# Altium schematic sheet RFID Sheet 1.SchDoc
size A4; SheetNumber: 1; SheetTotal: 2
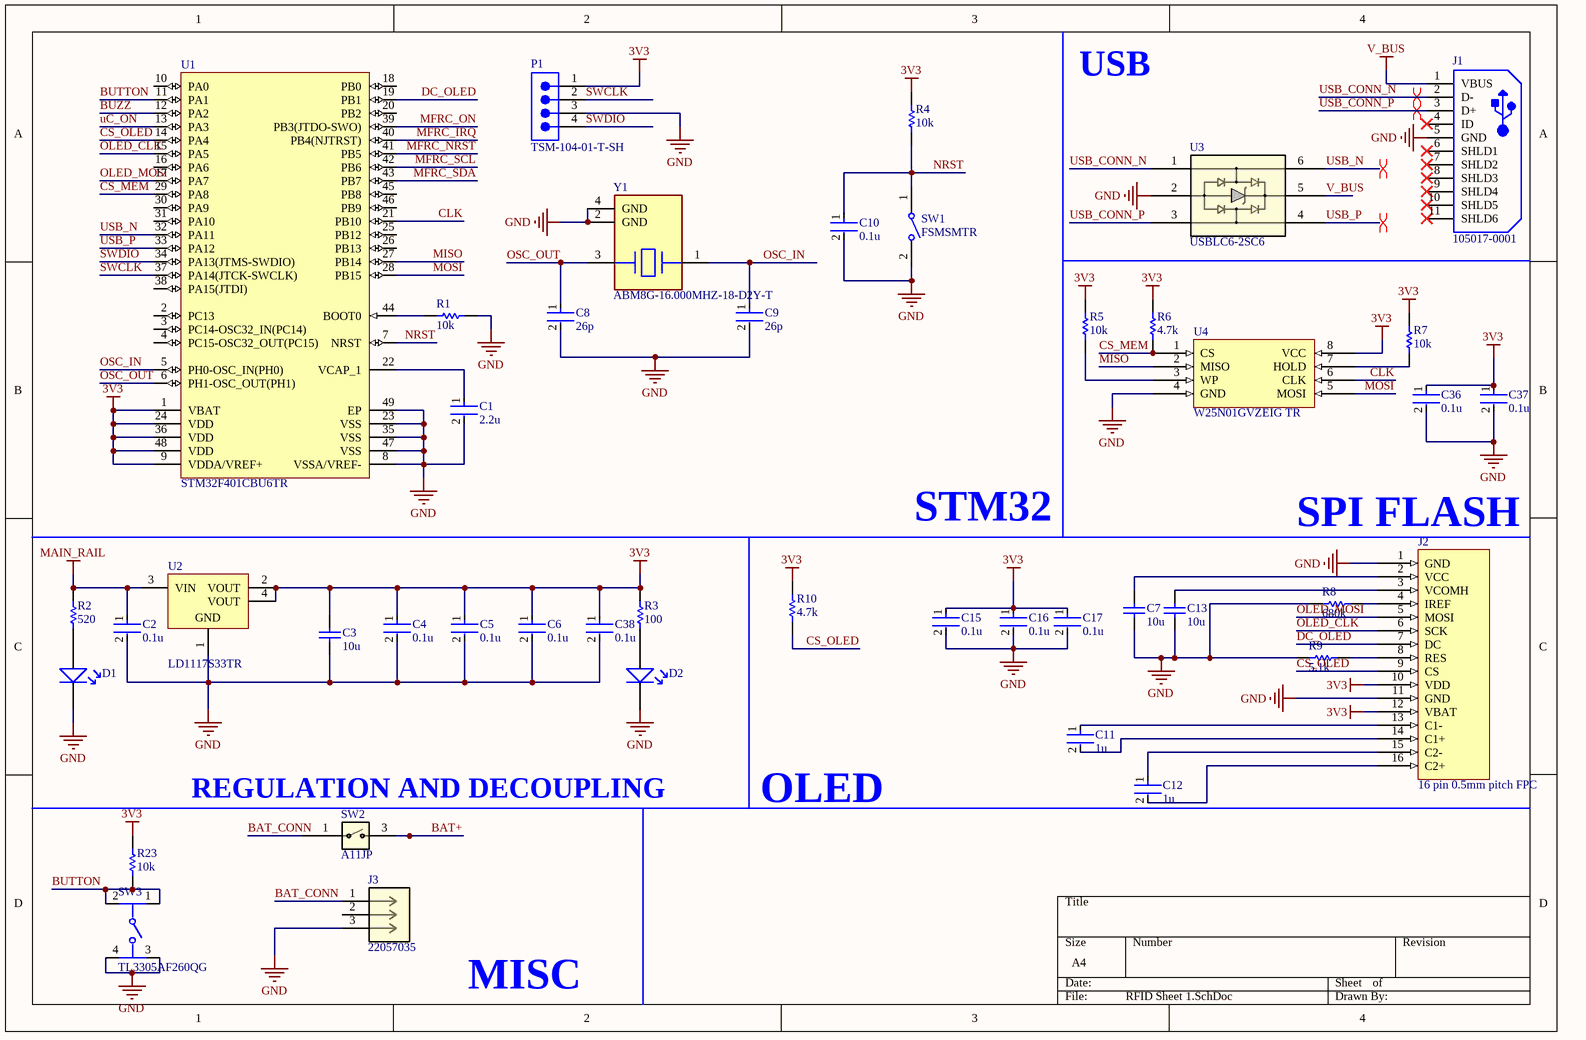
[diagram p0: RFID Sheet 1.SchDoc]

## Parts
C1  2.2u  [FP-C0603C-CF-MFG]
C2  0.1u  [FP-C0603C-CF-MFG]
C3  10u  [CAPC2013X88X50LL20T25]
C4  0.1u  [FP-C0603C-CF-MFG]
C5  0.1u  [FP-C0603C-CF-MFG]
C6  0.1u  [FP-C0603C-CF-MFG]
C7  10u  [CAPC2013X88X50LL20T25]
C8  26p  [FP-C0603C-CF-MFG]
C9  26p  [FP-C0603C-CF-MFG]
C10  0.1u  [FP-C0603C-CF-MFG]
C11  1u  [FP-C0603C-CF-MFG]
C12  1u  [FP-C0603C-CF-MFG]
C13  10u  [CAPC2013X88X50LL20T25]
C15  0.1u  [FP-C0603C-CF-MFG]
C16  0.1u  [FP-C0603C-CF-MFG]
C17  0.1u  [FP-C0603C-CF-MFG]
C36  0.1u  [FP-C0603C-CF-MFG]
C37  0.1u  [FP-C0603C-CF-MFG]
C38  0.1u  [FP-C0603C-CF-MFG]
D1  0603 LED  [0603 LED]  (value not drawn)
D2  0603 LED  [0603 LED]  (value not drawn)
J1  105017-0001  [USB-MICRO-B_V]
J2  16 pin 0.5mm pitch FPC  [16pin 0.5P FPC]
J3  22057035  [CON_22057035_MOL]
P1  TSM-104-01-T-SH  [SMTC-TSM-104-01-X-SH]
R1  10k  [RESC1609X50X30NL8T20]
R2  520  [RESC1609X50X30NL8T20]
R3  100  [RESC1609X50X30NL8T20]
R4  10k  [RESC1609X50X30NL8T20]
R5  10k  [RESC1609X50X30NL8T20]
R6  4.7k  [RESC1609X50X30NL8T20]
R7  10k  [RESC1609X50X30NL8T20]
R8  680k  [RESC1609X50X30NL8T20]
R9  5.1k  [RESC1609X50X30NL8T20]
R10  4.7k  [RESC1609X50X30NL8T20]
R23  10k  [RESC1609X50X30NL8T20]
SW1  FSMSMTR  [TECO-FSMSMTR_V]
SW2  A11JP  [A11JP_NKK]
SW3  TL3305AF260QG  [FP-TL3305AF260QG-MFG]
U1  STM32F401CBU6TR  [STM32F401CBU6]
U2  LD1117S33TR  [SOT230P700X180-4N]
U3  USBLC6-2SC6  [SOT23-6L_STM]
U4  W25N01GVZEIG TR  [W25N01GVZEIG]
Y1  ABM8G-16.000MHZ-18-D2Y-T  [FP-ABM8G-MFG]

## Nets
3V3: C3.2 C4.1 C5.1 C6.1 C15.1 C16.1 C17.1 C36.1 C37.1 C38.1 J2.10(VDD) J2.12(VBAT) P1.1 R3.2 R4.1 R5.2 R6.2 R7.2 R10.2 R23.2 U1.1(VBAT) U1.9(VDDA/VREF+) U1.24(VDD) U1.36(VDD) U1.48(VDD) U2.2(VOUT) U2.4(VOUT) U4.8(VCC)
GND: C1.2 C2.2 C3.1 C4.2 C5.2 C6.2 C7.1 C8.2 C9.2 C10.2 C13.1 C15.2 C16.2 C17.2 C36.2 C37.2 C38.2 D1.2 D2.2 J1.5(GND) J2.1(GND) J2.11(GND) J3.3 P1.3 R1.2 R8.2 R9.2 SW1.2 SW3.3 SW3.4 U1.8(VSSA/VREF-) U1.23(VSS) U1.35(VSS) U1.47(VSS) U1.49(EP) U2.1(GND) U3.2 U4.4(GND) Y1.2(GND) Y1.4(GND)
MAIN_RAIL: C2.1 R2.2 U2.3(VIN)
V_BUS: J1.1(VBUS) U3.5
BAT+: SW2.3
BAT_CONN: J3.1 SW2.1
BUTTON: R23.1 SW3.1 SW3.2 U1.11(PA1)
BUZZ: U1.12(PA2)
CLK: U1.21(PB10) U4.6(CLK)
CS_MEM: R6.1 U1.29(PA8) U4.1(CS)
CS_OLED: J2.9(CS) R10.1 U1.14(PA4)
DC_OLED: J2.7(DC) U1.19(PB1)
MFRC_IRQ: U1.40(PB4(NJTRST))
MFRC_NRST: U1.41(PB5)
MFRC_ON: U1.39(PB3(JTDO-SWO))
MFRC_SCL: U1.42(PB6)
MFRC_SDA: U1.43(PB7)
MISO: U1.27(PB14) U4.2(MISO)
MOSI: U1.28(PB15) U4.5(MOSI)
NRST: C10.1 R4.2 SW1.1 U1.7(NRST)
OLED_CLK: J2.6(SCK) U1.15(PA5)
OLED_MOSI: J2.5(MOSI) U1.17(PA7)
OSC_IN: C9.1 U1.5(PH0-OSC_IN(PH0)) Y1.1
OSC_OUT: C8.1 U1.6(PH1-OSC_OUT(PH1)) Y1.3
SWCLK: P1.2 U1.37(PA14(JTCK-SWCLK))
SWDIO: P1.4 U1.34(PA13(JTMS-SWDIO))
uC_ON: U1.13(PA3)
USB_CONN_N: J1.2(D-) U3.1
USB_CONN_P: J1.3(D+) U3.3
USB_N: U1.32(PA11) U3.6
USB_P: U1.33(PA12) U3.4
NetC1_1: C1.1 U1.22(VCAP_1)
NetC7_2: C7.2 J2.2(VCC)
NetC11_1: C11.1 J2.13(C1-)
NetC11_2: C11.2 J2.14(C1+)
NetC12_1: C12.1 J2.15(C2-)
NetC12_2: C12.2 J2.16(C2+)
NetC13_2: C13.2 J2.3(VCOMH)
NetD1_1: D1.1 R2.1
NetD2_1: D2.1 R3.1
NetJ2_4: J2.4(IREF) R8.1
NetJ2_8: J2.8(RES) R9.1
NetR1_1: R1.1 U1.44(BOOT0)
NetR5_1: R5.1 U4.3(WP)
NetR7_1: R7.1 U4.7(HOLD)

Not connected (* = marked no-connect by the designer): J1 4(ID)* 6(SHLD1)* 7(SHLD2)* 8(SHLD3)* 9(SHLD4)* 10(SHLD5)* 11(SHLD6)*; J3 2; U1 2(PC13) 3(PC14-OSC32_IN(PC14)) 4(PC15-OSC32_OUT(PC15)) 10(PA0) 16(PA6) 18(PB0) 20(PB2) 25(PB12) 26(PB13) 30(PA9) 31(PA10) 38(PA15(JTDI)) 45(PB8) 46(PB9)

## Layout directives
differential pair: USB_CONN_N, USB_CONN_P, USB_N, USB_P

## Notes on the sheet
- USB
- STM32
- (near J2) SPI FLASH
- (near SW2) REGULATION AND DECOUPLING
- OLED
- MISC

## Library data of the parts
C1 C2 C4-C6 C8-C12 C15-C17 C36-C38 = CMP-2006-03061-2: CAP CER 0.1UF 50V X7R 0603; Manufacturer: KEMET; Manufacturer Part Number: C0603C104K5RACTU; Tolerance: 0.1; Temperature Coefficient: 30ppm/°C; Material: Ceramic; Automotive Grade: Grade 1; Value: 0.10 μF; Temperature: -55°C to +125°C; RoHS: TRUE; Temperature Range High: +125°C; Lead Free: Yes; Octopart: https://octopart.com/c0603c104k5ractu-kemet-139244; Digikey Description: CAP CER 0.1UF 50V X7R 0603; Category: Cap; Package: C0603C-CF; ComponentLink2Description: Datasheet; Temperature Range Low: -55°C; Device Class L1: Passive Components; Voltage Rating: 50 V; Automotive: Yes; Device Class L3: Ceramic Capacitors; ComponentLink2URL: https://api.kemet.com/component-edge/download/datasheet/C0603C100J5GACAUTO.pdf; Capacitance: 0.10 μF; Device Class L2: Capacitors; Temperature Characteristic: X7R; Height: 0.87mm
C3 C7 C13 = CMP-2007-00266-1: Manufacturer: Kemet; Part Number: C0805C103K5RACTU
J1 = CMP-2000-05827-1: Micro-USB B Receptacle, Right Angle, Bottom Mount, Surface Mount, with Solder Tabs, -30 to 85 degC, 5-Pin USB, RoHS, Tape and Reel; Manufacturer: Molex; Featured Product: Micro-USBConnectorsUSBConnectors; Other Names: WM1399DKR; Package Version: Rev. F, 12/2012; Number of Contacts: 5; Connector Type: USB-microB; Catalog Drawings: 1050170001; 3D Model: 105017-0001.stp; Mating Products: WM17145-ND-CABLEMICROUSBBTOSTDA1.0MWM17147-ND-CABLEMICROUSBBTOSTDA2.0MWM17146-ND-CABLEMICROUSBBTOSTDA1.5M; PCN Assembly/Origin: ResinSupplier21/Oct/2015; Voltage - Max: 30V; Online Catalog: Molex-MicroUSB; Manufacturer URL: http://www.molex.com/; Package Description: 5-Leads USB, Micro B, Body 7.5 x 5 mm, Pitch 0.65 mm; Datasheet URL: http://www.molex.com/elqNow/elqRedir.htm?ref=http://www.molex.com/webdocs/datasheets/pdf/en-us/1050170001_IO_CONNECTORS.pdf; Ingress Protection: -; Datasheet Version: 03/2016; Mounting Type: BoardCutout,SurfaceMount,RightAngle; Circuits: 5; Standard Package: 1; Package Reference: MICRO-B; Package URL: http://www.molex.com/pdm_docs/sd/1050170001_sd.pdf; Category: Connectors,Interconnects; Series: -; RoHS Information: 1050170001CertofCompliance; Features: Shielded,SolderRetention; Family: USB,DVI,HDMIConnectors; Specifications: -; Gender: Receptacle; Packaging: Digi-Reel®; Mounting Technology: SurfaceMount
J3 = 22057035: No Description Available; Mfr_Name: Molex Connector Corporation; Copyright: Copyright (C) 2024 Ultra Librarian. All rights reserved.; Manufacturer_Part_Number: 22057035; RefDes: RefDes; Type: DEV
P1 = CMP-1024-00223-1: 0.025" SQ Post Header, Surface Mount, Horizontal, -55 to 105 degC, 2.54 mm Pitch, 4-Pin, Male, RoHS; Manufacturer: Samtec; Pitch: 2.54 mm; ComponentLink1URL: http://www.samtec.com; ComponentLink3URL: http://www.samtec.com/documents/webfiles/cpdf/TSM-1XX-XX-XXX-SH-XX-XXX-XX-MKT1.pdf; Temperature Range: -55 to 105 degC; Orientation: Horizontal; ComponentLink1Description: Manufacturer URL; PackageReference: TSM-104-01-X-SH; PackageDescription: Terminal Strip Single Surface Mount; ComponentLink2Description: Datasheet; ComponentLink2URL: http://www.samtec.com/documents/webfiles/pdf/TSM.PDF; RoHS: True; ComponentLink3Description: Package Specification; Mounting Technology: Surface Mount; PackageVersion: CD, 7/1991; PartNumber: TSM-104-01-T-SH; DatasheetVersion: F-214
R1-R10 R23 = CMP-1666-00005-4: Chip Resistor, 10 KOhm, +/- 1%, 100 mW, -55 to 155 degC, 0603 (1608 Metric), RoHS, Tape and Reel; Manufacturer: Vishay Semiconductor; Voltage Rating: 75 V; Max Operating Temperature: 155 degC; PackageDescription: 2-Pin Surface Mount Device, Body 1.575 x 0.85 mm; ComponentLink1Description: Manufacturer URL; RoHSCompliant: true; PackageReference: 0603; REACH SVHC: Unknown; Length: 1.55 mm; DatasheetVersion: 06/2012; Packaging: Tape and Reel; Min Operating Temperature: -55 degC; Mounting Technology: Surface Mount; ComponentLink2URL: https://datasheet.ciiva.com/11809/0900766b80d98afc-11809037.pdf; Height: 0.45 mm; ComponentLink2Description: Datasheet; Package Quantity: 5000; ComponentLink1URL: http://www.vishay.com/
SW1 = CMP-2000-07501-1: FSMSM Push Button Switch, 50 mA, -35 to 85 degC, 2-Pin SMD, RoHS, Tape and Reel; Manufacturer: TE Connectivity; Voltage Rating (DC): 24V; Electrical Life: 20000Cycles; Operating Force: 180gf; Switch Travel: 0.25mm; Contact Current Rating: 50mA; Case\/Package: SMD/SMT; Actuator Length: 1.07mm; Throw Configuration: SPST; Actuator Material: Polyamide; Contact Resistance: 100mOhm; Illumination Type: Illuminated; Max Voltage Rating (DC): 12V; Manufacturer URL: http://www.te.com/; Lead Free: LeadFree; Packaging: TapeandReel; Min Operating Temperature: -35degC; Mechanical Life: 20000Cycles; Mount: SurfaceMount; REACH SVHC: Unknown; Package Quantity: 1800; Package Reference: FSMSMTR; RoHSCompliant: true; Max Operating Temperature: 85degC; Orientation: Straight; ELV: Compliant; Datasheet URL: http://www.te.com/commerce/DocumentDelivery/DDEController?Action=showdoc&DocId=Customer+Drawing%7F1437566-3%7FC2%7Fpdf%7FEnglish%7FENG_CD_1437566-3_C2_1437566_3_1_c.dwg.pdf%7F1437566-4; Package Description: 2-Pin Surface Mount Device, Body 6 x 3.5 mm, Pitch 9.19 mm; Current Rating: 50mA; Contact Plating: Silver; Termination: GullWing; Datasheet Version: Rev. C2, 08/2014; Contact Material: Brass; Mounting Technology: SurfaceMount
SW2 = A11JP: No Description Available; Mfr_Name: NKK Switches; Type: DEV; Copyright: Copyright (C) 2024 Ultra Librarian. All rights reserved.; Manufacturer_Part_Number: A11JP; RefDes: RefDes
SW3 = CMP-17879-000010-1: SWITCH TACTILE SPST-NO 50MA 12V; Mechanical Life: 200000Cycles; Switch Function: Off-Mom; Actuator Type: Standard; Operating Force: 260gf; Illumination Type: Non-Illuminated; Switch Travel: 0.2mm; Throw Configuration: SPST; Min Operating Temperature: -20°C; Max Operating Temperature: 70°C; Lead Free: Lead Free; Mount: Surface Mount; Packaging: Tape and Reel; Termination: Gull Wing
U1 = CMP-0243-00136-1: ARM Cortex-M4 32-bit MCU+FPU, 128 KB Flash, 64 KB Internal RAM, 36 I/Os, 48-Pin UFQFPN, -40 to 85 degC, Tape and Reel; Manufacturer: STMicroelectronics; Internal RAM Size (kB): 64; FLASH Size (Prog) (kB): 128; Operating Frequency(F) (Processor speed) (MHz): 84; I/Os (High Current): 36; Supply Voltage(Vcc) min (V): 1.7; Package Reference: 48-Pin Ultra Thin Fine Pitch Quad Flat No-Lead, 7 x 7 x 0.6 mm Body, 0.5 mm Pitch, Exposed Pad; Package Description: UFQFPN48; ComponentLink1Description: Manufacturer URL; ComponentLink2URL: http://www.st.com/st-web-ui/static/active/en/resource/technical/document/datasheet/DM00086815.pdf; ComponentLink2Description: Datasheet; ComponentLink1URL: http://www.st.com/; Mounting Technology: Surface Mount; Packing: Tape and Reel; Core: ARM Cortex-M4; DatasheetVersion: Rev. 5; Manufacturer Part Number: STM32F401CBU6TR
U2 = LD1117S33TR: Fixed Positive LDO Regulator, 3.3V, 1.2V Dropout, BIPolar, PDSO4; Manufacturer: STMicroelectronics; Package Body Material: Plastic; Dropout Voltage1-Nom: 1.1V; Input Voltage Absolute-Max: 15V; Min Input Voltage: 4.75V; Line Regulation-Max: 0.006%; Load Regulation-Max: 0.01%; Channels: 1; Output Current1-Max: 1.3A; Output Voltage1-Max: 3.365V; Output Voltage1-Min: 3.235V; Regulator Type: FIXED POSITIVE SINGLE OUTPUT LDO REGULATOR; Time @ Peak Reflow Temperature-Max (s): 30s; Voltage Tolerance-Max: 2%; Qualification Status: Not Qualified; Supplier: Mouser; Supplier Part Number: 511-LD1117S33; Manufacturer Part Number: LD1117S33TR; RoHS: Yes; Category: Voltage Regulators - Linear; Stock: 175247; Pricing: 1=0.64, 10=0.53, 50=0.53, 100=0.386, 1000=0.291, 10000=0.229 (USD); Case/Package: SOP; Pins: 3; Package Shape: Rectangular; Terminal Finish: Tin; JESD-609 Code: e3; Adjustability: FIXED; Dropout Voltage1-Max: 1.2V; Max Supply Voltage: 15V; JESD-30 Code: R-PDSO-G3; Moisture Sensitivity Level: 1; Number of Outputs: 1; Operating Temperature, TJ-Max: 125°C; Operating Temperature, TJ-Min: 0°C; Output Voltage1-Nom: 3.3V; Package Style: SMALL OUTLINEMeter; Packaging: Tape and Reel; Peak Reflow Temperature (Cel): 260°C; Surface Mount: Yes; Technology: BIPOLAR; Terminal Form: Gull Wing; Terminal Position: DUAL; Length: 6.5mm; Width: 3.5mm; Height - Seated (Max): 1.9mm; Terminal Pitch: 2.3mm; RoHS Compliant: Yes; Reach SVHC Compliant: No; ComponentLink1URL: https://datasheet.ciiva.com:443/pdfs/VipMasterIC/IC/SGST/SGST-S-A0009691890/SGST-S-A0009691890-1.pdf?src-supplier=IHS+Markit; ComponentLink1Description: https://datasheet.ciiva.com:443/pdfs/VipMasterIC/IC/SGST/SGST-S-A0009691890/SGST-S-A0009691890-1.pdf?src-supplier=IHS+Markit; ComponentLink2URL: https://datasheet.ciiva.com/19478/1390240-19478097.pdf?src-supplier=Jameco; ComponentLink2Description: https://datasheet.ciiva.com/19478/1390240-19478097.pdf?src-supplier=Jameco; ComponentLink3URL: https://datasheet.ciiva.com/1511/1776449-1511573.pdf?src-supplier=Element14; ComponentLink3Description: https://datasheet.ciiva.com/1511/1776449-1511573.pdf?src-supplier=Element14; ComponentLink4URL: https://datasheet.ciiva.com/7992/1776449-7992621.pdf?src-supplier=Element14; ComponentLink4Description: https://datasheet.ciiva.com/7992/1776449-7992621.pdf?src-supplier=Element14; ComponentLink5URL: https://datasheet.ciiva.com/28652/1776449-28652462.pdf?src-supplier=Element14; ComponentLink5Description: https://datasheet.ciiva.com/28652/1776449-28652462.pdf?src-supplier=Element14; ComponentLink6URL: https://datasheet.ciiva.com/2041/cd00000544-2041942.pdf?src-supplier=Digi-Key; ComponentLink6Description: https://datasheet.ciiva.com/2041/cd00000544-2041942.pdf?src-supplier=Digi-Key; ComponentLink7URL: https://datasheet.ciiva.com/2041/cd00000544-2041941.pdf?src-supplier=Digi-Key; ComponentLink7Description: https://datasheet.ciiva.com/2041/cd00000544-2041941.pdf?src-supplier=Digi-Key; ComponentLink8URL: https://datasheet.ciiva.com/2041/cd00000544-2041943.pdf?src-supplier=Digi-Key; ComponentLink8Description: https://datasheet.ciiva.com/2041/cd00000544-2041943.pdf?src-supplier=Digi-Key; ComponentLink9URL: https://datasheet.ciiva.com/16396/cd00000544-16396459.pdf?src-supplier=Future+Electronics; ComponentLink9Description: https://datasheet.ciiva.com/16396/cd00000544-16396459.pdf?src-supplier=Future+Electronics
U3 = USBLC6-2SC6: No Description Available; Mfr_Name: STMicroelectronics; Copyright: Copyright (C) 2023 Ultra Librarian. All rights reserved.; Manufacturer_Part_Number: USBLC6-2SC6; RefDes: RefDes; Type: DEV
Y1 = CMP-27762-006537-2: Crystal 16MHz ±20ppm (Tol) ±30ppm (Stability) 18pF FUND 80Ω 4-Pin SMD T/R; Series Resistance: 80R; Radiation Hardening: No; Load Capacitance: 18pF; Package Quantity: 1000; Frequency Stability: 30ppm; ESR (Equivalent Series Resistance): 80R; Depth: 2.5mm; Height: 1mm; Number of Pins: 4; Frequency Tolerance: 20ppm; Frequency: 16MHz; Tolerance: 20ppm; Min Operating Temperature: -40°C; Length: 3.2mm; Termination: SMD/SMT; Max Operating Temperature: 85°C; Width: 2.5mm; Series: ABM8G; Mount: Surface Mount; Case/Package: CSMD; Lead Free: Lead Free; Operating Frequency: 16 MHz; Packaging: Tape and Reel